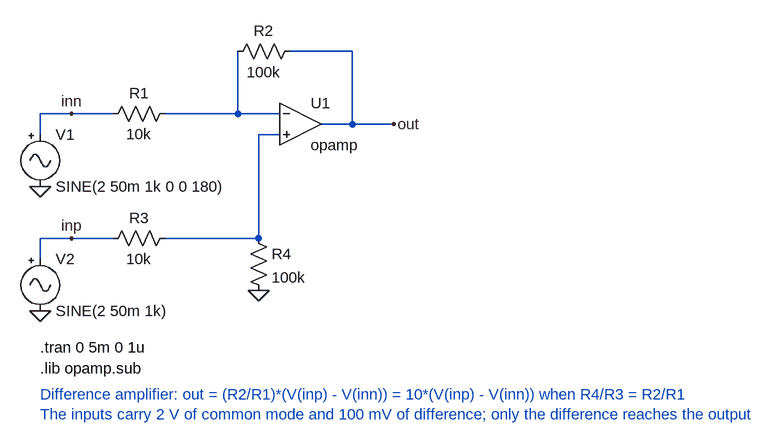
[diagram p0: schematic difference_amplifier.asc]
difference_amplifier.asc, the LTspice schematic file:
Version 4
SHEET 1 880 680
WIRE 336 48 336 144
WIRE 512 48 416 48
WIRE 512 160 512 48
WIRE 32 144 32 176
WIRE 144 144 32 144
WIRE 400 144 224 144
WIRE 576 160 464 160
WIRE 368 176 400 176
WIRE 368 336 368 176
WIRE 32 336 32 368
WIRE 144 336 32 336
WIRE 368 336 224 336
FLAG 32 256 0
FLAG 32 448 0
FLAG 368 416 0
FLAG 80 144 inn
FLAG 80 336 inp
FLAG 576 160 out
SYMBOL Misc\signal 32 160 R0
SYMATTR InstName V1
SYMATTR Value SINE(2 50m 1k 0 0 180)
SYMBOL Misc\signal 32 352 R0
SYMATTR InstName V2
SYMATTR Value SINE(2 50m 1k)
SYMBOL res 240 128 R90
WINDOW 0 0 56 VBottom 2
WINDOW 3 32 56 VTop 2
SYMATTR InstName R1
SYMATTR Value 10k
SYMBOL res 432 32 R90
WINDOW 0 0 56 VBottom 2
WINDOW 3 32 56 VTop 2
SYMATTR InstName R2
SYMATTR Value 100k
SYMBOL res 240 320 R90
WINDOW 0 0 56 VBottom 2
WINDOW 3 32 56 VTop 2
SYMATTR InstName R3
SYMATTR Value 10k
SYMBOL res 352 320 R0
SYMATTR InstName R4
SYMATTR Value 100k
SYMBOL OpAmps\opamp 432 96 R0
SYMATTR InstName U1
TEXT 32 504 Left 2 !.tran 0 5m 0 1u
TEXT 32 536 Left 2 !.lib opamp.sub
TEXT 32 576 Left 2 ;Difference amplifier: out = (R2/R1)*(V(inp) - V(inn)) = 10*(V(inp) - V(inn)) when R4/R3 = R2/R1\nThe inputs carry 2 V of common mode and 100 mV of difference; only the difference reaches the output

The netlist it stands for:
* difference_amplifier.asc
V1 inn 0 SINE(2 50m 1k 0 0 180)
V2 inp 0 SINE(2 50m 1k)
R1 N001 inn 10k
R2 out N001 100k
R3 N002 inp 10k
R4 N002 0 100k
XU1 N001 N002 out opamp Aol=100K GBW=10Meg  ; pins invin noninvin out
.tran 0 5m 0 1u
.lib opamp.sub
* Difference amplifier: out = (R2/R1)*(V(inp) - V(inn)) = 10*(V(inp) - V(inn)) when R4/R3 = R2/R1
* The inputs carry 2 V of common mode and 100 mV of difference; only the difference reaches the output
.backanno
.end